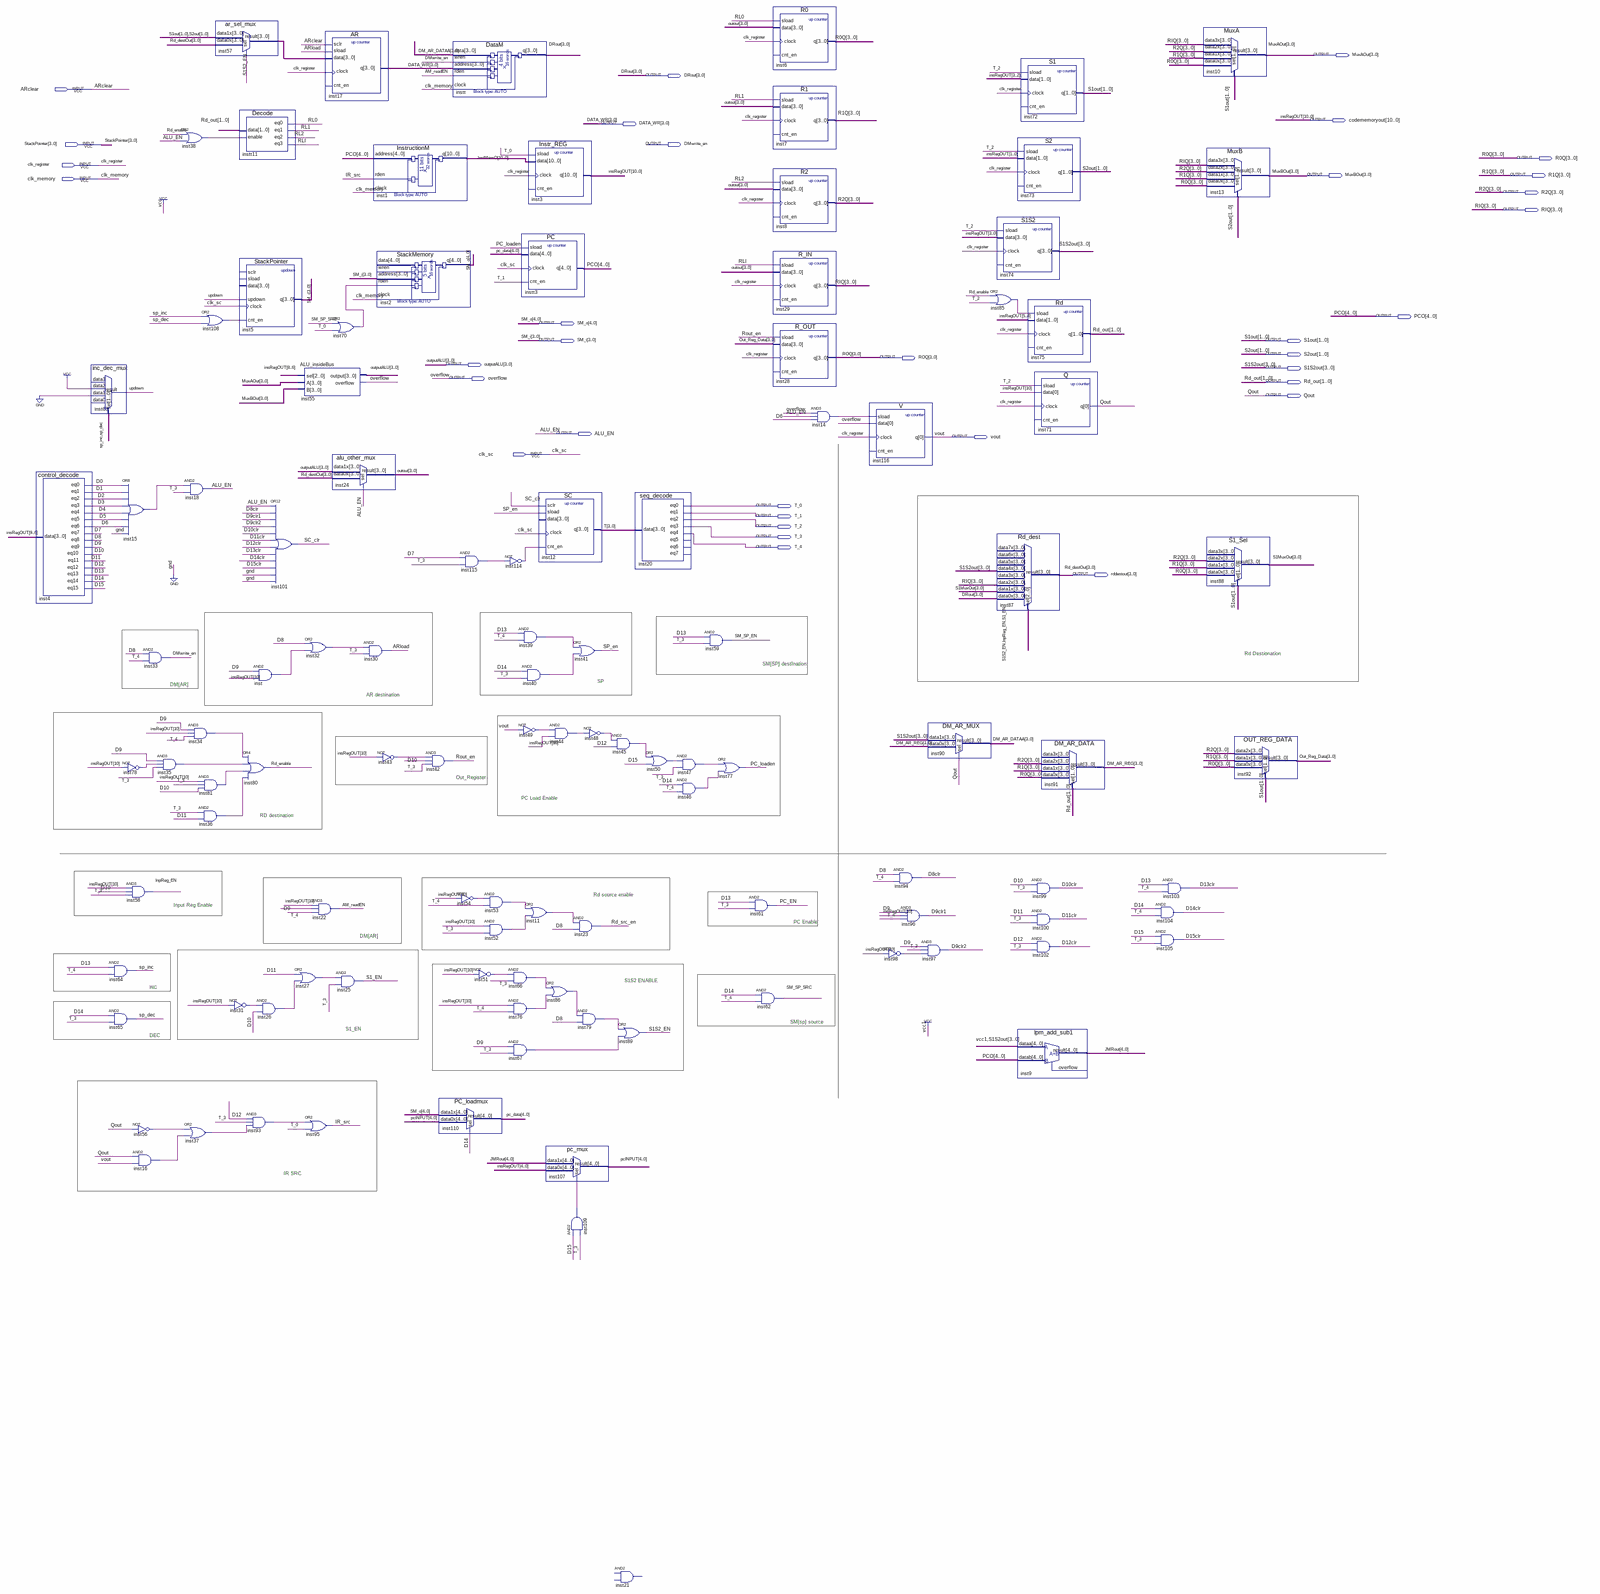
[diagram p0: schematic sheet, whole]
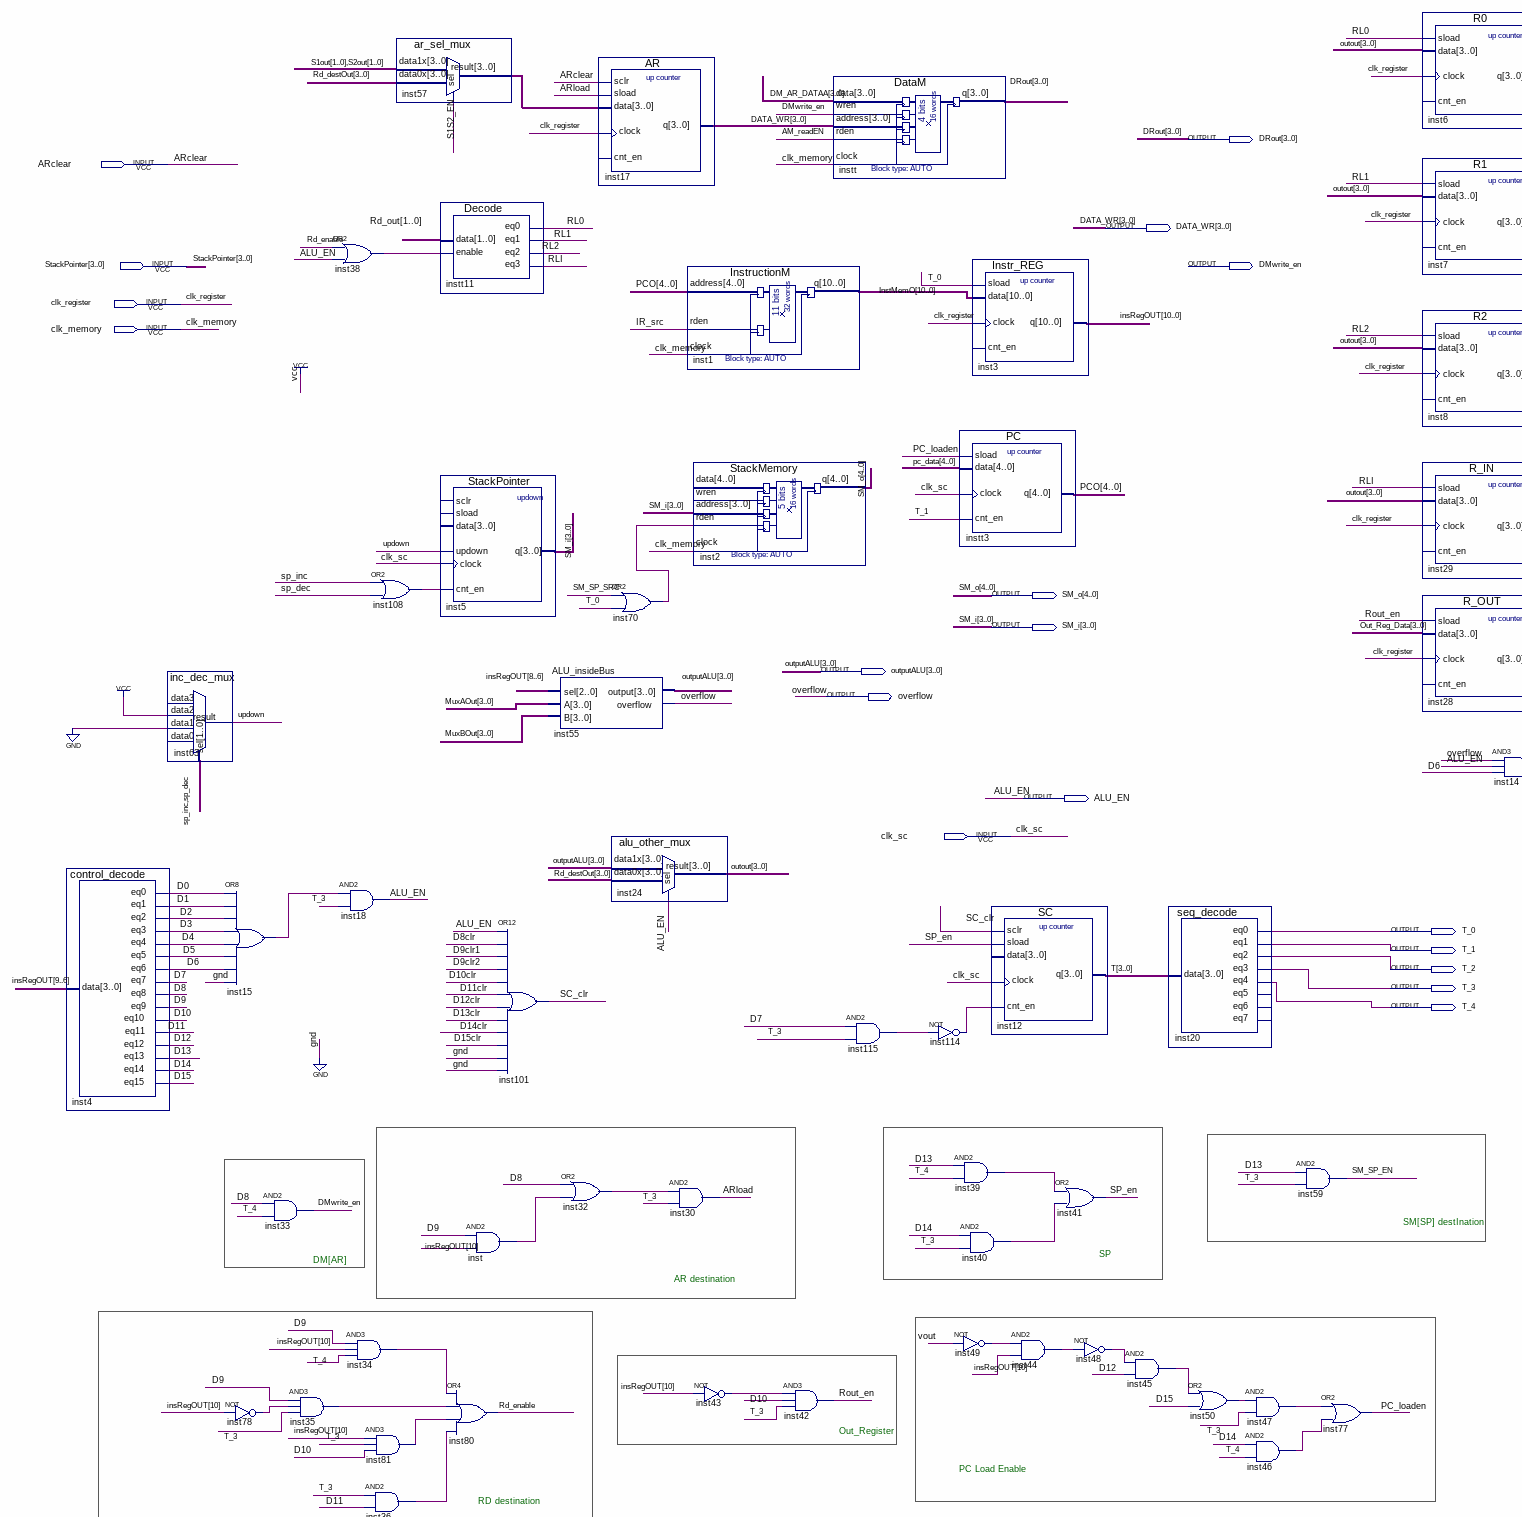
[diagram p1: schematic sheet, upper left part]
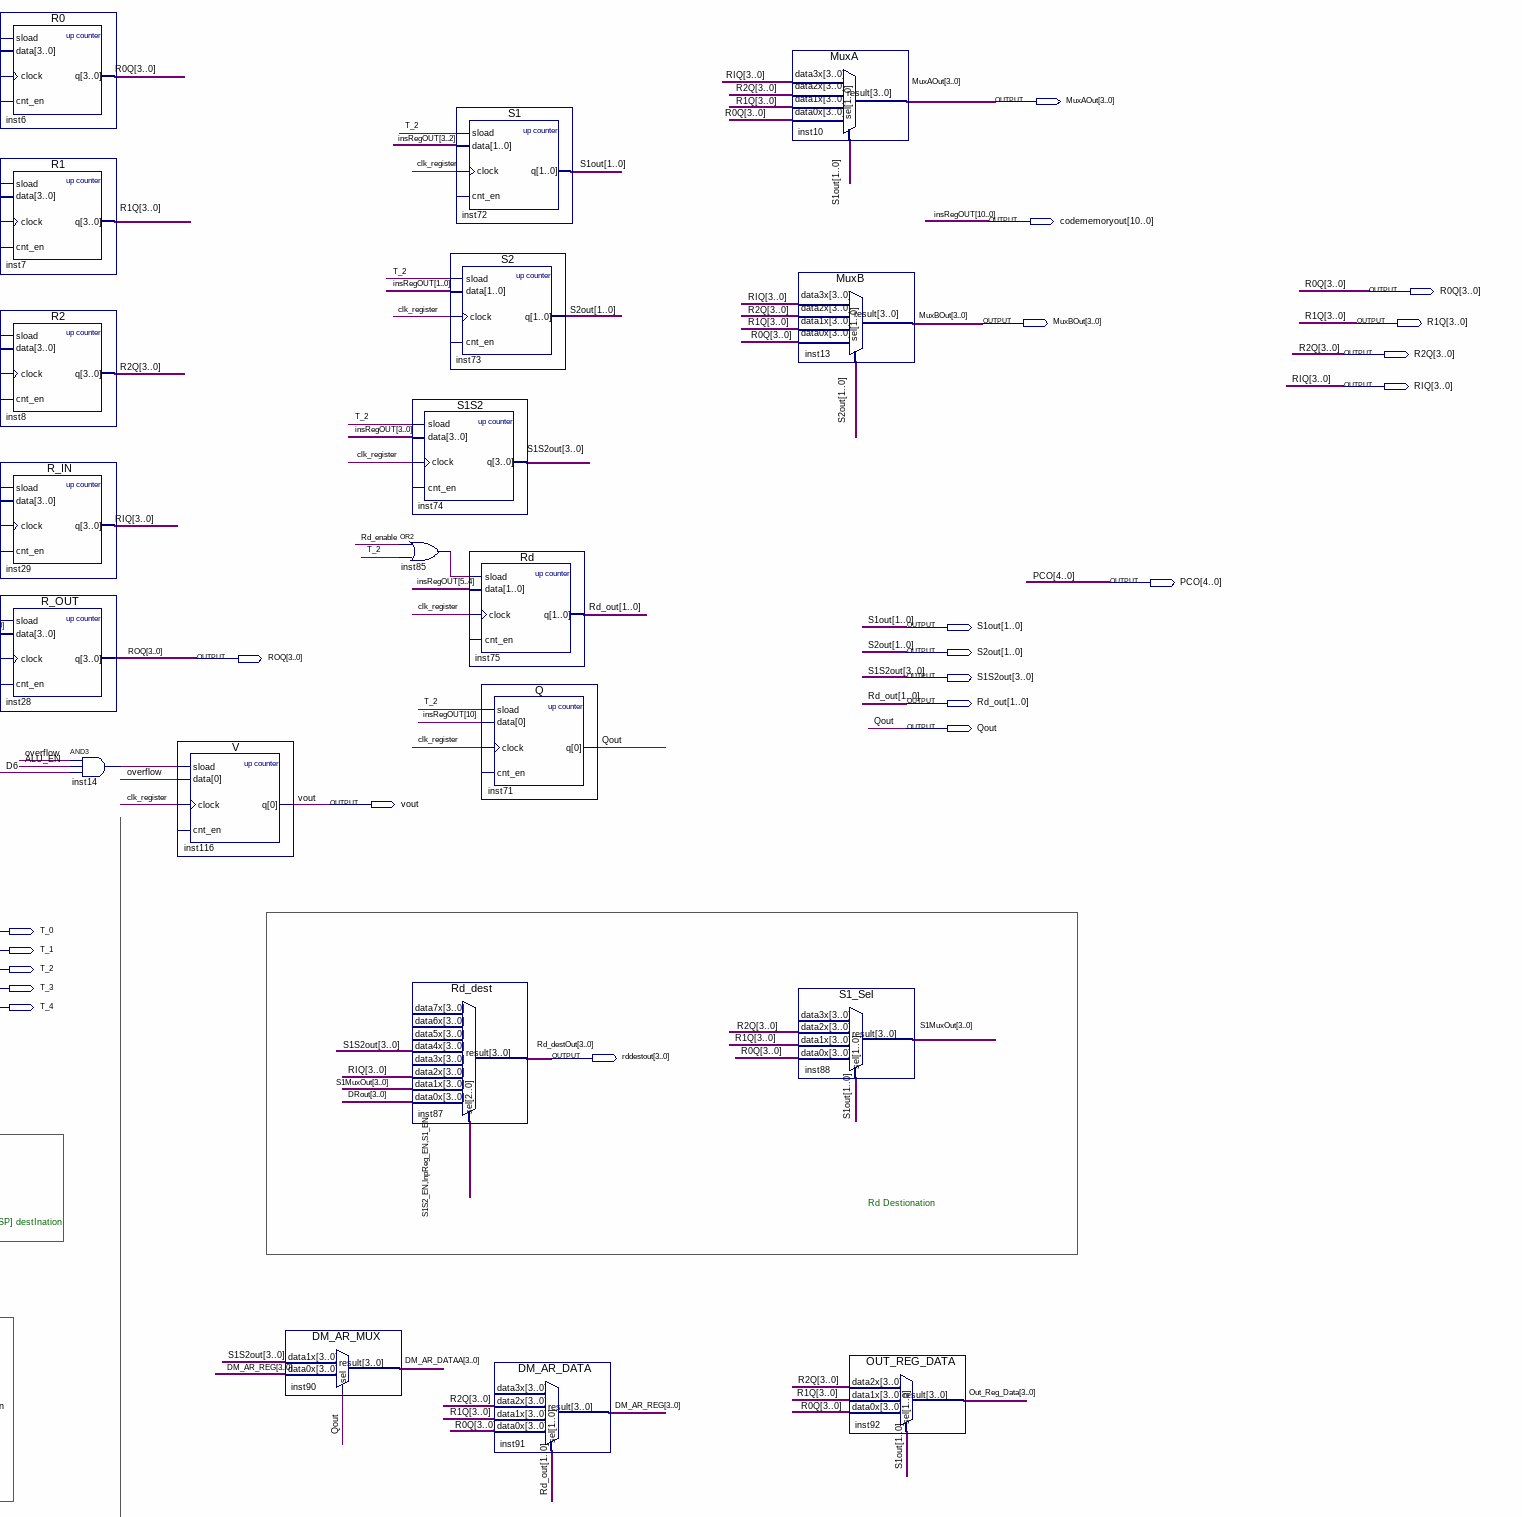
[diagram p2: schematic sheet, upper right part]
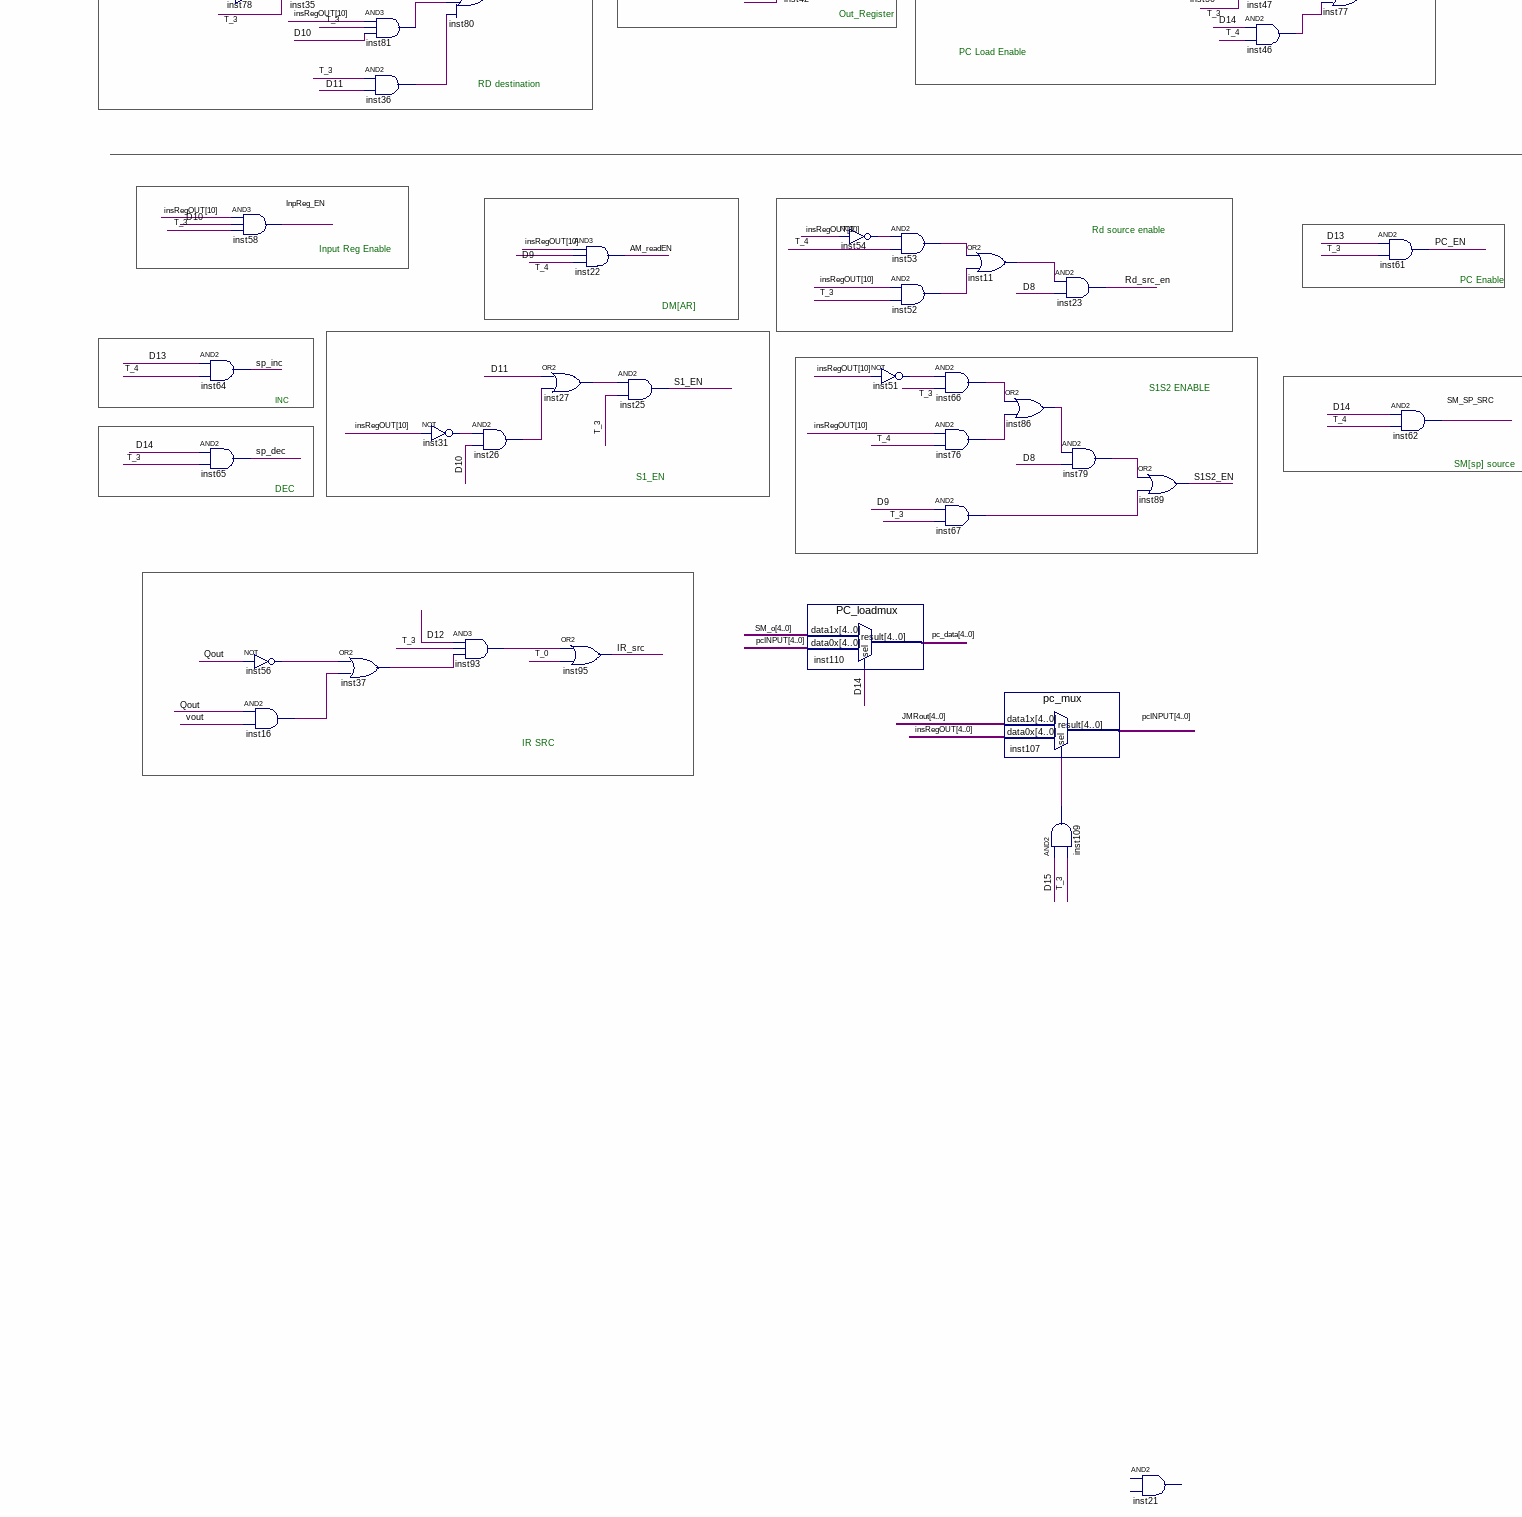
[diagram p3: schematic sheet, lower left part]
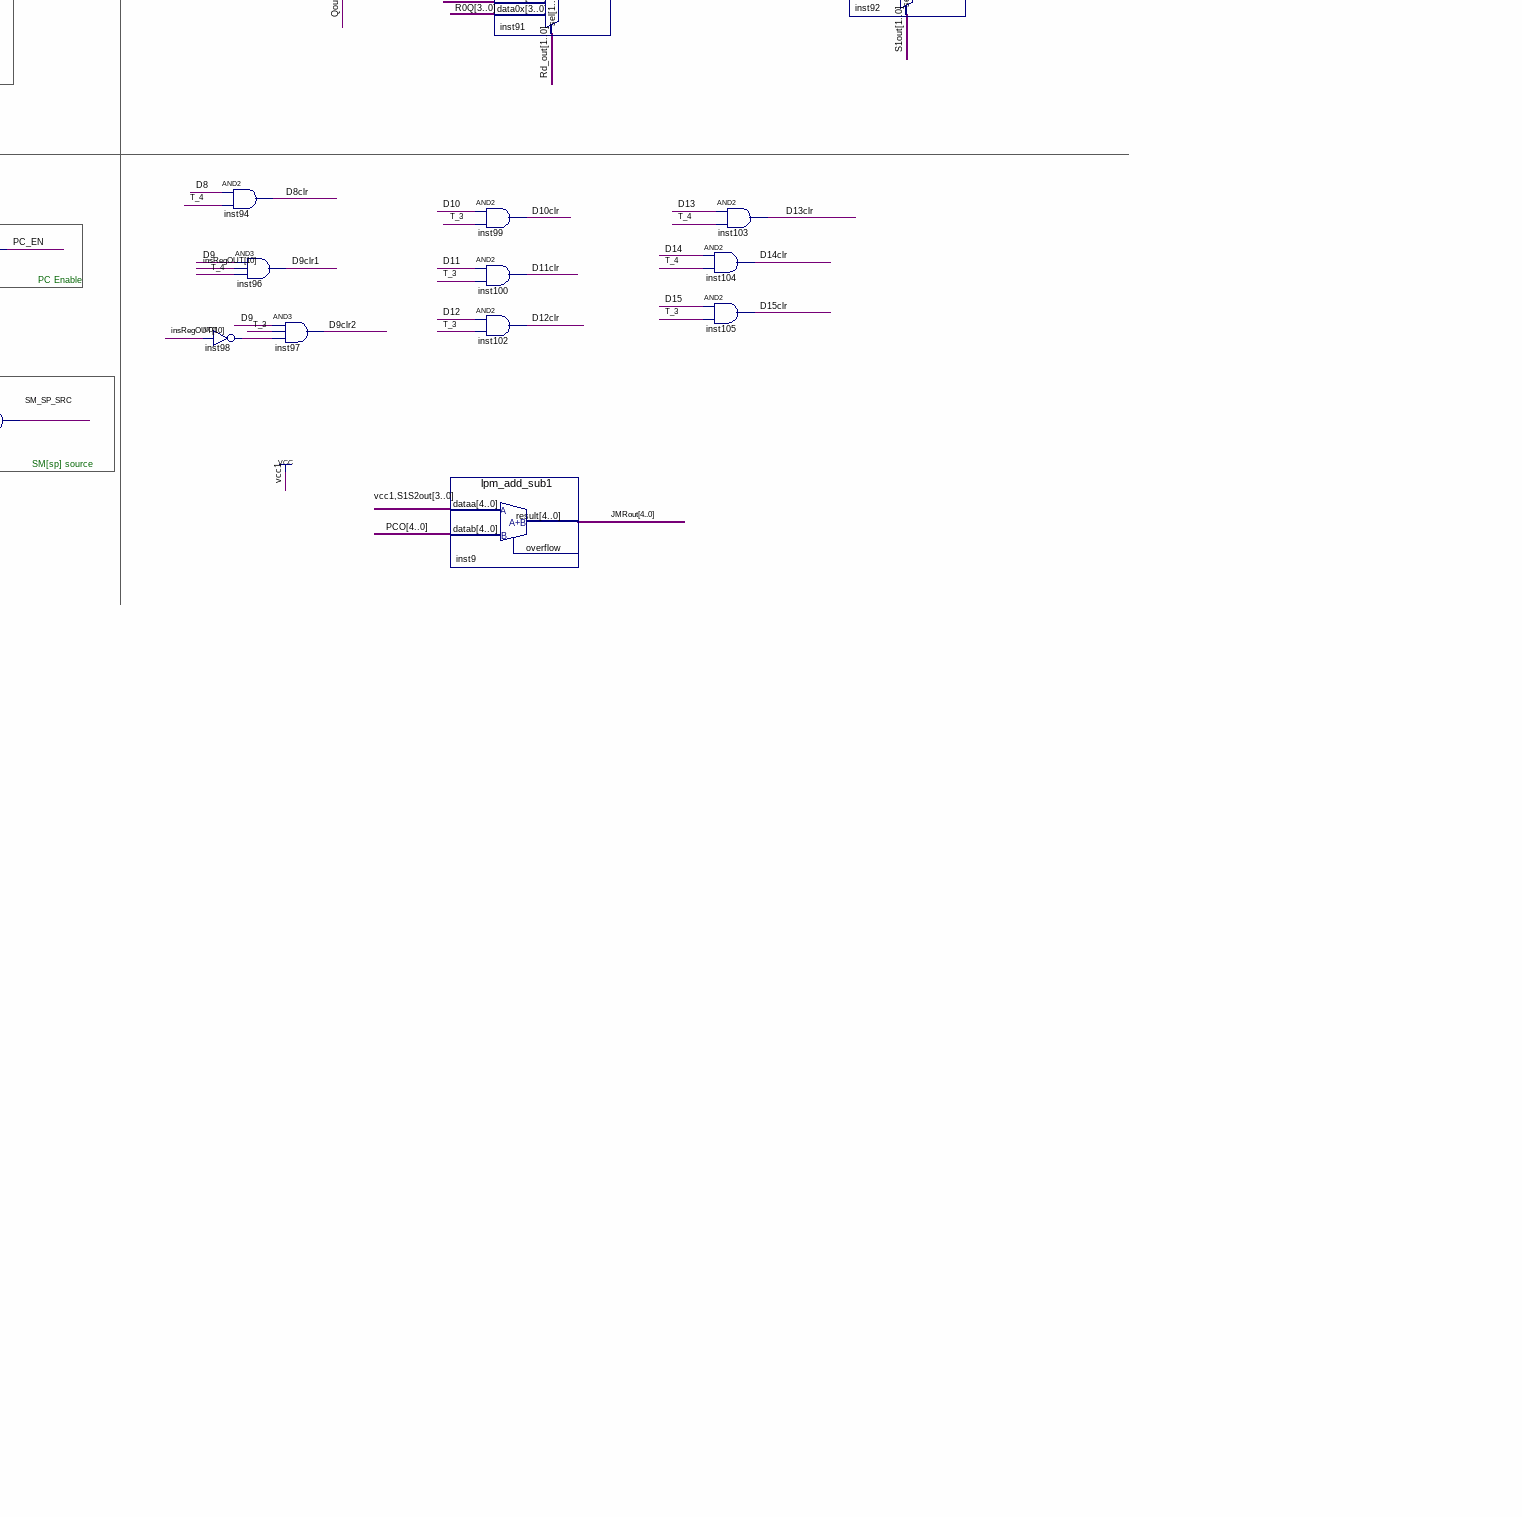
[diagram p4: schematic sheet, lower right part]
// Quartus schematic BUS.bdf as structural Verilog: 109 symbols, 34 pins
module BUS (
  input  ARclear,
  input  [3:0] StackPointer,
  input  clk_register,
  input  clk_memory,
  input  clk_sc,
  output [3:0] MuxAOut,
  output [3:0] DRout,
  output [10:0] codememoryout,
  output [3:0] DATA_WR,
  output DMwrite_en,
  output [3:0] R0Q,
  output [3:0] MuxBOut,
  output [3:0] R1Q,
  output [3:0] R2Q,
  output [3:0] RIQ,
  output [4:0] PCO,
  output [4:0] SM_o,
  output [3:0] SM_i,
  output [1:0] S1out,
  output [1:0] S2out,
  output [3:0] ROQ,
  output [3:0] outputALU,
  output [3:0] S1S2out,
  output overflow,
  output [1:0] Rd_out,
  output Qout,
  output ALU_EN,
  output vout,
  output T_0,
  output T_1,
  output T_2,
  output T_3,
  output T_4,
  output [3:0] rddestout
);

  wire AM_readEN, ARload, D0, D1, D2, D3, D4, D5, D6, D7, D8, D8clr, D9, D9clr1, D9clr2, D10, D10clr, D11,
       D11clr, D12, D12clr, D13, D13clr, D14, D14clr, D15, D15clr, InpReg_EN, inst11_out, inst14_out,
       inst15_out, inst16_out, inst26_out, inst27_out, inst31_out, inst32_out, inst34_out, inst35_out,
       inst36_out, inst37_out, inst38_out, inst39_out, inst40_out, inst43_out, inst44_out, inst45_out,
       inst46_out, inst47_out, inst48_out, inst49_out, inst50_out, inst51_out, inst52_out, inst53_out,
       inst54_out, inst56_out, inst66_out, inst67_out, inst70_out, inst76_out, inst78_out, inst79_out,
       inst81_out, inst85_out, inst86_out, inst93_out, inst98_out, inst108_out, inst109_out, inst114_out,
       inst115_out, inst_out, IR_src, PC_EN, PC_loaden, Rd_enable, Rd_src_en, RL0, RL1, RL2, RLI, Rout_en,
       S1_EN, S1S2_EN, SC_clr, SM_SP_EN, SM_SP_SRC, sp_dec, SP_en, sp_inc, updown;
  wire [3:0] DM_AR_DATAA, DM_AR_REG, inst57_result, Out_Reg_Data, outout, S1MuxOut, T;
  wire [4:0] JMRout, pc_data, pcINPUT;
  wire [10:0] InstMemO;

  control_decode inst4 (
    .data(codememoryout[9:6]), .eq0(D0), .eq1(D1), .eq2(D2), .eq3(D3), .eq4(D4), .eq5(D5), .eq6(D6),
    .eq7(D7), .eq8(D8), .eq9(D9), .eq10(D10), .eq11(D11), .eq12(D12), .eq13(D13), .eq14(D14), .eq15(D15));
  inc_dec_mux inst63 (.data2(1'b1), .data1(1'b0), .sel({sp_inc, sp_dec}), .result(updown));  // open: data3, data0
  and inst64 (sp_inc, D13, T_4);
  and inst65 (sp_dec, D14, T_3);
  or inst15 (inst15_out, D0, D1, D2, D3, D4, D5, D6, 1'b0);
  not inst78 (inst78_out, codememoryout[10]);
  and inst58 (InpReg_EN, codememoryout[10], D10, T_3);
  not inst56 (inst56_out, Qout);
  and inst16 (inst16_out, Qout, vout);
  and inst33 (DMwrite_en, D8, T_4);
  and inst35 (inst35_out, D9, inst78_out, T_3);
  or inst38 (inst38_out, Rd_enable, ALU_EN);
  and inst18 (ALU_EN, inst15_out, T_3);
  and inst34 (inst34_out, D9, codememoryout[10], T_4);
  or inst37 (inst37_out, inst56_out, inst16_out);
  ar_sel_mux inst57 (.data1x({S1out, S2out}), .data0x(rddestout), .sel(S1S2_EN), .result(inst57_result));
  or inst108 (inst108_out, sp_inc, sp_dec);
  and inst81 (inst81_out, codememoryout[10], T_3, D10);
  and inst36 (inst36_out, T_3, D11);
  Decode instt11 (.data(Rd_out), .enable(inst38_out), .eq0(RL0), .eq1(RL1), .eq2(RL2), .eq3(RLI));
  StackPointer inst5 (.updown(updown), .clock(clk_sc), .cnt_en(inst108_out), .q(SM_i));  // open: sclr, sload, data
  or inst80 (Rd_enable, inst34_out, inst35_out, inst81_out, inst36_out);
  not inst31 (inst31_out, codememoryout[10]);
  and inst93 (inst93_out, D12, T_3, inst37_out);
  or inst101 (SC_clr, ALU_EN, D8clr, D9clr1, D9clr2, D10clr, D11clr, D12clr, D13clr, D14clr, D15clr, 1'b0, 1'b0);
  and inst (inst_out, D9, codememoryout[10]);
  and inst26 (inst26_out, inst31_out, D10);
  ALU_insideBus inst55 (.sel(codememoryout[8:6]), .A(MuxAOut), .B(MuxBOut), .\output (outputALU), .overflow(overflow));
  or inst32 (inst32_out, D8, inst_out);
  or inst27 (inst27_out, D11, inst26_out);
  or inst95 (IR_src, inst93_out, T_0);
  AR inst17 (.sclr(ARclear), .sload(ARload), .data(inst57_result), .clock(clk_register), .q(DATA_WR));  // open: cnt_en
  or inst70 (inst70_out, SM_SP_SRC, T_0);
  alu_other_mux inst24 (.data1x(outputALU), .data0x(rddestout), .sel(ALU_EN), .result(outout));
  and inst22 (AM_readEN, codememoryout[10], D9, T_4);
  and inst25 (S1_EN, inst27_out, T_3);
  InstructionM inst1 (.address(PCO), .rden(IR_src), .clock(clk_memory), .q(InstMemO));
  StackMemory inst2 (.address(SM_i), .rden(inst70_out), .clock(clk_memory), .q(SM_o));  // open: data, wren
  and inst30 (ARload, inst32_out, T_3);
  not inst43 (inst43_out, codememoryout[10]);
  and inst42 (Rout_en, inst43_out, D10, T_3);
  PC_loadmux inst110 (.data1x(SM_o), .data0x(pcINPUT), .sel(D14), .result(pc_data));
  DataM instt (
    .data(DM_AR_DATAA), .wren(DMwrite_en), .address(DATA_WR), .rden(AM_readEN), .clock(clk_memory), .q(DRout));
  and inst115 (inst115_out, D7, T_3);
  not inst54 (inst54_out, codememoryout[10]);
  and inst53 (inst53_out, inst54_out, T_4);
  and inst52 (inst52_out, codememoryout[10], T_3);
  not inst51 (inst51_out, codememoryout[10]);
  PC instt3 (.sload(PC_loaden), .data(pc_data), .clock(clk_sc), .cnt_en(T_1), .q(PCO));
  not inst114 (inst114_out, inst115_out);
  and inst39 (inst39_out, D13, T_4);
  and inst40 (inst40_out, D14, T_3);
  not inst49 (inst49_out, vout);
  or inst11 (inst11_out, inst53_out, inst52_out);
  and inst66 (inst66_out, inst51_out, T_3);
  and inst76 (inst76_out, codememoryout[10], T_4);
  and inst67 (inst67_out, D9, T_3);
  Instr_REG inst3 (.sload(T_0), .data(InstMemO), .clock(clk_register), .q(codememoryout));  // open: cnt_en
  SC inst12 (.sclr(SC_clr), .sload(SP_en), .clock(clk_sc), .cnt_en(inst114_out), .q(T));  // open: data
  and inst44 (inst44_out, inst49_out, codememoryout[10]);
  or inst86 (inst86_out, inst66_out, inst76_out);
  pc_mux inst107 (.data1x(JMRout), .data0x(codememoryout[4:0]), .sel(inst109_out), .result(pcINPUT));
  or inst41 (SP_en, inst39_out, inst40_out);
  and inst23 (Rd_src_en, inst11_out, D8);
  and inst79 (inst79_out, inst86_out, D8);
  and inst109 (inst109_out, D15, T_3);
  not inst48 (inst48_out, inst44_out);
  seq_decode inst20 (.data(T), .eq0(T_0), .eq1(T_1), .eq2(T_2), .eq3(T_3), .eq4(T_4));  // open: eq5, eq6, eq7
  and inst45 (inst45_out, inst48_out, D12);
  or inst89 (S1S2_EN, inst79_out, inst67_out);
  // AND2 inst21 is placed but not wired
  or inst50 (inst50_out, inst45_out, D15);
  and inst47 (inst47_out, inst50_out, T_3);
  and inst46 (inst46_out, D14, T_4);
  and inst59 (SM_SP_EN, D13, T_3);
  or inst77 (PC_loaden, inst47_out, inst46_out);
  R0 inst6 (.sload(RL0), .data(outout), .clock(clk_register), .q(R0Q));  // open: cnt_en
  R1 inst7 (.sload(RL1), .data(outout), .clock(clk_register), .q(R1Q));  // open: cnt_en
  R2 inst8 (.sload(RL2), .data(outout), .clock(clk_register), .q(R2Q));  // open: cnt_en
  R_IN inst29 (.sload(RLI), .data(outout), .clock(clk_register), .q(RIQ));  // open: cnt_en
  R_OUT inst28 (.sload(Rout_en), .data(Out_Reg_Data), .clock(clk_register), .q(ROQ));  // open: cnt_en
  and inst61 (PC_EN, D13, T_3);
  and inst62 (SM_SP_SRC, D14, T_4);
  and inst14 (inst14_out, overflow, ALU_EN, D6);
  V inst116 (.sload(inst14_out), .data(overflow), .clock(clk_register), .q(vout));  // open: cnt_en
  not inst98 (inst98_out, codememoryout[10]);
  and inst94 (D8clr, D8, T_4);
  and inst96 (D9clr1, D9, codememoryout[10], T_4);
  DM_AR_MUX inst90 (.data1x(S1S2out), .data0x(DM_AR_REG), .sel(Qout), .result(DM_AR_DATAA));
  and inst97 (D9clr2, D9, T_3, inst98_out);
  or inst85 (inst85_out, Rd_enable, T_2);
  S1 inst72 (.sload(T_2), .data(codememoryout[3:2]), .clock(clk_register), .q(S1out));  // open: cnt_en
  S2 inst73 (.sload(T_2), .data(codememoryout[1:0]), .clock(clk_register), .q(S2out));  // open: cnt_en
  S1S2 inst74 (.sload(T_2), .data(codememoryout[3:0]), .clock(clk_register), .q(S1S2out));  // open: cnt_en
  Rd_dest inst87 (
    .data4x(S1S2out), .data2x(RIQ), .data1x(S1MuxOut), .data0x(DRout), .sel({S1S2_EN, InpReg_EN, S1_EN}),
    .result(rddestout));  // open: data7x, data6x, data5x, data3x
  lpm_add_sub1 inst9 (.dataa({1'b1, S1S2out}), .datab(PCO), .result(JMRout));  // open: overflow
  Rd inst75 (.sload(inst85_out), .data(codememoryout[5:4]), .clock(clk_register), .q(Rd_out));  // open: cnt_en
  Q inst71 (.sload(T_2), .data(codememoryout[10]), .clock(clk_register), .q(Qout));  // open: cnt_en
  DM_AR_DATA inst91 (.data2x(R2Q), .data1x(R1Q), .data0x(R0Q), .sel(Rd_out), .result(DM_AR_REG));  // open: data3x
  and inst99 (D10clr, D10, T_3);
  and inst100 (D11clr, D11, T_3);
  and inst102 (D12clr, D12, T_3);
  and inst104 (D14clr, D14, T_4);
  and inst105 (D15clr, D15, T_3);
  and inst103 (D13clr, D13, T_4);
  MuxA inst10 (.data3x(RIQ), .data2x(R2Q), .data1x(R1Q), .data0x(R0Q), .sel(S1out), .result(MuxAOut));
  MuxB inst13 (.data3x(RIQ), .data2x(R2Q), .data1x(R1Q), .data0x(R0Q), .sel(S2out), .result(MuxBOut));
  S1_Sel inst88 (.data2x(R2Q), .data1x(R1Q), .data0x(R0Q), .sel(S1out), .result(S1MuxOut));  // open: data3x
  OUT_REG_DATA inst92 (.data2x(R2Q), .data1x(R1Q), .data0x(R0Q), .sel(S1out), .result(Out_Reg_Data));

  // Other names for the same wires on the sheet: insRegOUT[10:0] = codememoryout; Rd_destOut[3:0] = rddestout

  // Notes on the sheet:
  //   Rd Destionation
  //   SM[SP] destInation
  //   SP
  //   DM[AR]
  //   AR destination
  //   Out_Register
  //   PC Load Enable
  //   RD destination
  //   Rd source enable
  //   Input Reg Enable
  //   PC Enable
  //   DM[AR]
  //   S1S2 ENABLE
  //   INC
  //   SM[sp] source
  //   S1_EN
  //   DEC
  //   IR SRC
endmodule
